# Altium schematic sheet rad_detector_v500_PSU.SchDoc
size A4; SheetNumber: 3; SheetTotal: 7
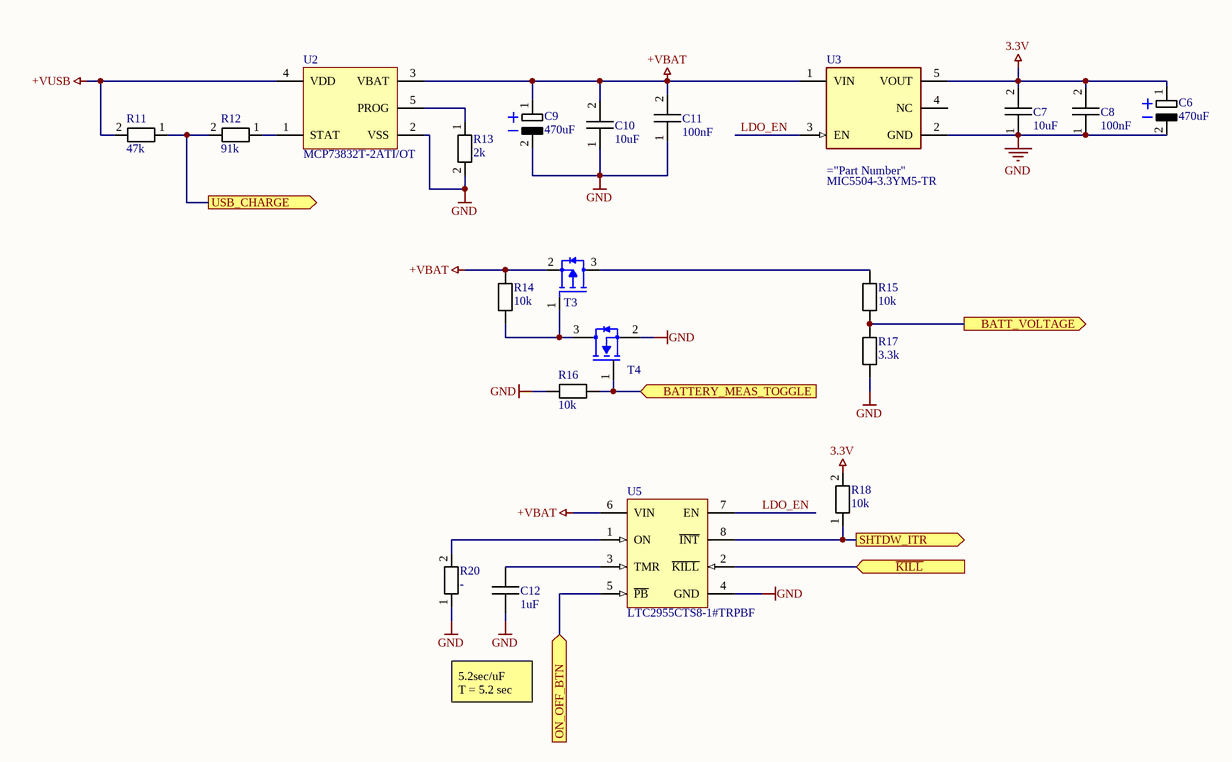
[diagram p0: rad_detector_v500_PSU.SchDoc]

## Parts
C6  470uF  [CAPAE9383X110M]
C7  10uF  [1210_C]
C8  100nF  [0805_C]
C9  470uF  [CAPAE9383X110M]
C10  10uF  [1210_C]
C11  100nF  [0805_C]
C12  1uF  [0805_C]
R11  47k  [0805]
R12  91k  [0805]
R13  2k  [0805]
R14  10k  [0805]
R15  10k  [0805]
R16  10k  [0805]
R17  3.3k  [0805]
R18  10k  [0805]
R20  -  [0805]
T3  BSS84  [SOT23]  (value not drawn)
T4  MMBF170  [SOT23]  (value not drawn)
U2  MCP73832T-2ATI/OT  [SOT23-5]
U3  MIC5504-3.3YM5-TR  [SOT23-5]
U5  LTC2955CTS8-1#TRPBF  [LT-TS8-8-TSOT-23_V]

## Ports
BATT_VOLTAGE (out, see rad_detector_v500_MAIN[4C], rad_detector_v500_MCU[2B]), BATTERY_MEAS_TOGGLE (in, see rad_detector_v500_MAIN[4C]), ON_OFF_BTN (in, see rad_detector_v500_MAIN[4C]), SHTDW_ITR (out, see rad_detector_v500_MAIN[4B], rad_detector_v500_MCU[2B]), USB_CHARGE (out, see rad_detector_v500_MAIN[4B], rad_detector_v500_MCU[3B]), ~{KILL} (in, see rad_detector_v500_MAIN[4B], rad_detector_v500_MCU[3B])

## Nets
3.3V: C6.1 C7.2 C8.2 R18.2 U3.5(VOUT)
+VBAT: C9.1 C10.2 C11.2 R14.2 T3.2(S) U2.3(VBAT) U3.1(VIN) U5.6(VIN)
+VUSB: R11.2 U2.4(VDD)
GND: C6.2 C7.1 C8.1 C9.2 C10.1 C11.1 C12.2 R13.2 R16.1 R17.1 R20.1 T4.2(Source) U2.2(VSS) U3.2(GND) U5.4(GND)
BATT_VOLTAGE: R15.1 R17.2 ; port BATT_VOLTAGE
BATTERY_MEAS_TOGGLE: R16.2 T4.1(Gate) ; port BATTERY_MEAS_TOGGLE
~{KILL}: U5.2(~{KILL}) ; port ~{KILL}
LDO_EN: U3.3(EN) U5.7(EN)
ON_OFF_BTN: U5.5(~{PB}) ; port ON_OFF_BTN
SHTDW_ITR: R18.1 U5.8(~{INT}) ; port SHTDW_ITR
USB_CHARGE: R11.1 R12.2 ; port USB_CHARGE
NetC12_1: C12.1 U5.3(TMR)
NetR12_1: R12.1 U2.1(STAT)
NetR13_1: R13.1 U2.5(PROG)
NetR14_1: R14.1 T3.1(G) T4.3(Drain)
NetR15_2: R15.2 T3.3(D)
NetR20_2: R20.2 U5.1(ON)

Not connected (* = marked no-connect by the designer): U3 4(NC)

## Notes on the sheet
- 5.2sec/uF
  T = 5.2 sec

## Library data of the parts
C6 C9 = CAPACITOR_ELCO
C7 C8 C10-C12 = CAPACITOR
R11-R13 R17 R20 = RESISTOR: Parameter 1: 10k
R14-R16 R18 = RESISTOR: Parameter 1: 10k
T3 = BSS84: P-Chanel MOSFET
T4 = MMBF170: N MOSFET
U2 = MCP73832T-2ATI/OT: Miniature Single-Cell, Fully Integrated Li-Ion, Li-Polymer Charge Management Controller, 4.2V, 5-Pin SOT-23, Industrial Temperature, Tape and Reel
U5 = LTC2955CTS8-1: Pushbutton On / Off Controller with Automatic Turn-On, 8-pin SOT23 (TS8-8), 0 to 70 degC, Pb-Free, Tape and Reel